# Altium schematic sheet SD Card.SchDoc
size A; SheetNumber: 10; SheetTotal: 15
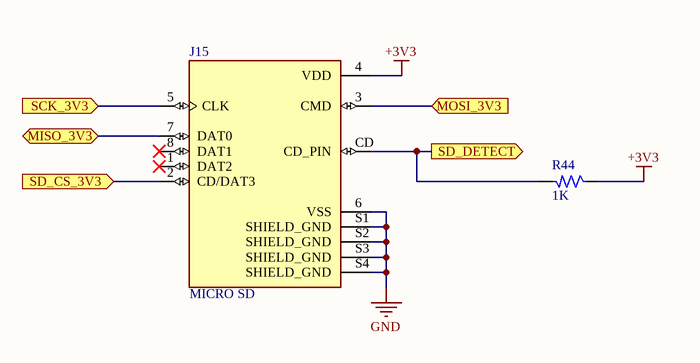
[diagram p0: SD Card.SchDoc]

## Parts
J15  MICRO SD  [AMPHENOL_GTFP08131Y2HR]
R44  1K  [RES_0805]

## Ports
MISO_3V3 (bidir, see Block Diagram[1C], SPI Bus Transceiver[3B], WIFI[2B]), MOSI_3V3 (in, see Block Diagram[1C], SPI Bus Transceiver[3C], WIFI[2B]), SCK_3V3 (in, see Block Diagram[1C], SPI Bus Transceiver[3C], WIFI[2B]), SD_CS_3V3 (in, see Block Diagram[2C], SPI Bus Transceiver[3C]), SD_DETECT (out, see Block Diagram[2C], ATMEGA2560-16AU[1C])

## Nets
+3V3: J15.4(VDD) R44.1
GND: J15.6(VSS) J15.S1(SHIELD_GND) J15.S2(SHIELD_GND) J15.S3(SHIELD_GND) J15.S4(SHIELD_GND)
MISO_3V3: J15.7(DAT0) ; port MISO_3V3
MOSI_3V3: J15.3(CMD) ; port MOSI_3V3
SCK_3V3: J15.5(CLK) ; port SCK_3V3
SD_CS_3V3: J15.2(CD/DAT3) ; port SD_CS_3V3
SD_DETECT: J15.CD(CD_PIN) R44.2 ; port SD_DETECT

Not connected (* = marked no-connect by the designer): J15 1(DAT2)* 8(DAT1)*

## Library data of the parts
J15 = MICRO SD: GTFP08131Y2HR; Availability: Unavailable; Price: None; MP: GTFP08131Y2HR; Package: None; Value: *
R44 = RES_1K-0.125W-1%-0805: 1 kOhms ±1% 0.125W, 1/8W Chip Resistor 0805 (2012 Metric) Moisture Resistant Thick Film; Manufacturer: Walsin; Manufacturer Part Number: WR08X1001FTL; Case/Package: 0805; Supplier-1: SP ROAD; Supplier Part Number-1: RC0805JR-071KL; Alternate Part Number-1: WR08X1001FTL